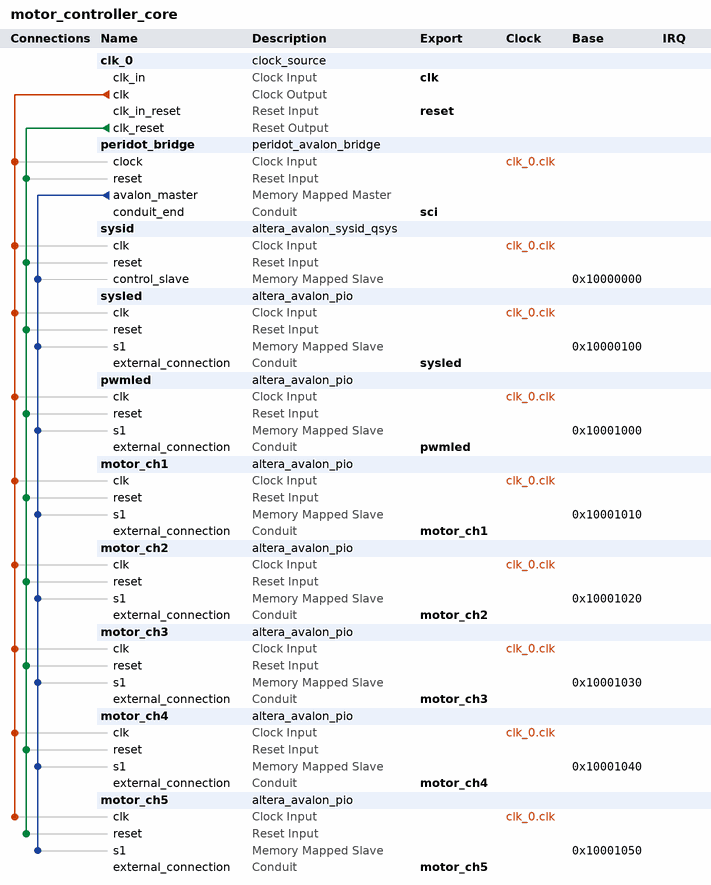
[diagram p0: system contents]
# Platform Designer (Qsys) system motor_controller_core, Cyclone IV E EP4CE6E22C8
# Parameters at their usual value, and those the tool derives, are not listed.
package require -exact qsys 14.0
create_system motor_controller_core
set_project_property DEVICE_FAMILY {Cyclone IV E}
set_project_property DEVICE EP4CE6E22C8

add_instance clk_0 clock_source 14.0
set_instance_parameter_value clk_0 clockFrequency 50000000

add_instance peridot_bridge peridot_avalon_bridge 0.9

add_instance sysid altera_avalon_sysid_qsys 14.0
set_instance_parameter_value sysid id 538183728

add_instance sysled altera_avalon_pio 14.0
set_instance_parameter_value sysled direction Output
set_instance_parameter_value sysled width 1

add_instance pwmled altera_avalon_pio 14.0
set_instance_parameter_value pwmled direction Output
set_instance_parameter_value pwmled width 8

add_instance motor_ch1 altera_avalon_pio 14.0
set_instance_parameter_value motor_ch1 direction Output
set_instance_parameter_value motor_ch1 width 10

add_instance motor_ch2 altera_avalon_pio 14.0
set_instance_parameter_value motor_ch2 direction Output
set_instance_parameter_value motor_ch2 width 10

add_instance motor_ch3 altera_avalon_pio 14.0
set_instance_parameter_value motor_ch3 direction Output
set_instance_parameter_value motor_ch3 width 10

add_instance motor_ch4 altera_avalon_pio 14.0
set_instance_parameter_value motor_ch4 direction Output
set_instance_parameter_value motor_ch4 width 10

add_instance motor_ch5 altera_avalon_pio 14.0
set_instance_parameter_value motor_ch5 direction Output
set_instance_parameter_value motor_ch5 width 10

# connections
add_connection clk_0.clk motor_ch1.clk clock
add_connection clk_0.clk motor_ch2.clk clock
add_connection clk_0.clk motor_ch3.clk clock
add_connection clk_0.clk motor_ch4.clk clock
add_connection clk_0.clk motor_ch5.clk clock
add_connection clk_0.clk peridot_bridge.clock clock
add_connection clk_0.clk pwmled.clk clock
add_connection clk_0.clk sysid.clk clock
add_connection clk_0.clk sysled.clk clock
add_connection clk_0.clk_reset motor_ch1.reset reset
add_connection clk_0.clk_reset motor_ch2.reset reset
add_connection clk_0.clk_reset motor_ch3.reset reset
add_connection clk_0.clk_reset motor_ch4.reset reset
add_connection clk_0.clk_reset motor_ch5.reset reset
add_connection clk_0.clk_reset peridot_bridge.reset reset
add_connection clk_0.clk_reset pwmled.reset reset
add_connection clk_0.clk_reset sysid.reset reset
add_connection clk_0.clk_reset sysled.reset reset
add_connection peridot_bridge.avalon_master motor_ch1.s1 avalon
set_connection_parameter_value peridot_bridge.avalon_master/motor_ch1.s1 baseAddress 0x10001010
add_connection peridot_bridge.avalon_master motor_ch2.s1 avalon
set_connection_parameter_value peridot_bridge.avalon_master/motor_ch2.s1 baseAddress 0x10001020
add_connection peridot_bridge.avalon_master motor_ch3.s1 avalon
set_connection_parameter_value peridot_bridge.avalon_master/motor_ch3.s1 baseAddress 0x10001030
add_connection peridot_bridge.avalon_master motor_ch4.s1 avalon
set_connection_parameter_value peridot_bridge.avalon_master/motor_ch4.s1 baseAddress 0x10001040
add_connection peridot_bridge.avalon_master motor_ch5.s1 avalon
set_connection_parameter_value peridot_bridge.avalon_master/motor_ch5.s1 baseAddress 0x10001050
add_connection peridot_bridge.avalon_master pwmled.s1 avalon
set_connection_parameter_value peridot_bridge.avalon_master/pwmled.s1 baseAddress 0x10001000
add_connection peridot_bridge.avalon_master sysid.control_slave avalon
set_connection_parameter_value peridot_bridge.avalon_master/sysid.control_slave baseAddress 0x10000000
add_connection peridot_bridge.avalon_master sysled.s1 avalon
set_connection_parameter_value peridot_bridge.avalon_master/sysled.s1 baseAddress 0x10000100

# exported interfaces
add_interface clk clock sink
set_interface_property clk EXPORT_OF clk_0.clk_in
add_interface reset reset sink
set_interface_property reset EXPORT_OF clk_0.clk_in_reset
add_interface sci conduit end
set_interface_property sci EXPORT_OF peridot_bridge.conduit_end
add_interface motor_ch1 conduit end
set_interface_property motor_ch1 EXPORT_OF motor_ch1.external_connection
add_interface motor_ch2 conduit end
set_interface_property motor_ch2 EXPORT_OF motor_ch2.external_connection
add_interface motor_ch3 conduit end
set_interface_property motor_ch3 EXPORT_OF motor_ch3.external_connection
add_interface motor_ch4 conduit end
set_interface_property motor_ch4 EXPORT_OF motor_ch4.external_connection
add_interface motor_ch5 conduit end
set_interface_property motor_ch5 EXPORT_OF motor_ch5.external_connection
add_interface pwmled conduit end
set_interface_property pwmled EXPORT_OF pwmled.external_connection
add_interface sysled conduit end
set_interface_property sysled EXPORT_OF sysled.external_connection

set_interconnect_requirement {$system} qsys_mm.clockCrossingAdapter HANDSHAKE
set_interconnect_requirement {$system} qsys_mm.maxAdditionalLatency 1
set_interconnect_requirement {$system} qsys_mm.insertDefaultSlave FALSE

save_system motor_controller_core.qsys
